# Altium schematic sheet 2V_REG.SchDoc
size A4; SheetNumber: 2; SheetTotal: 12
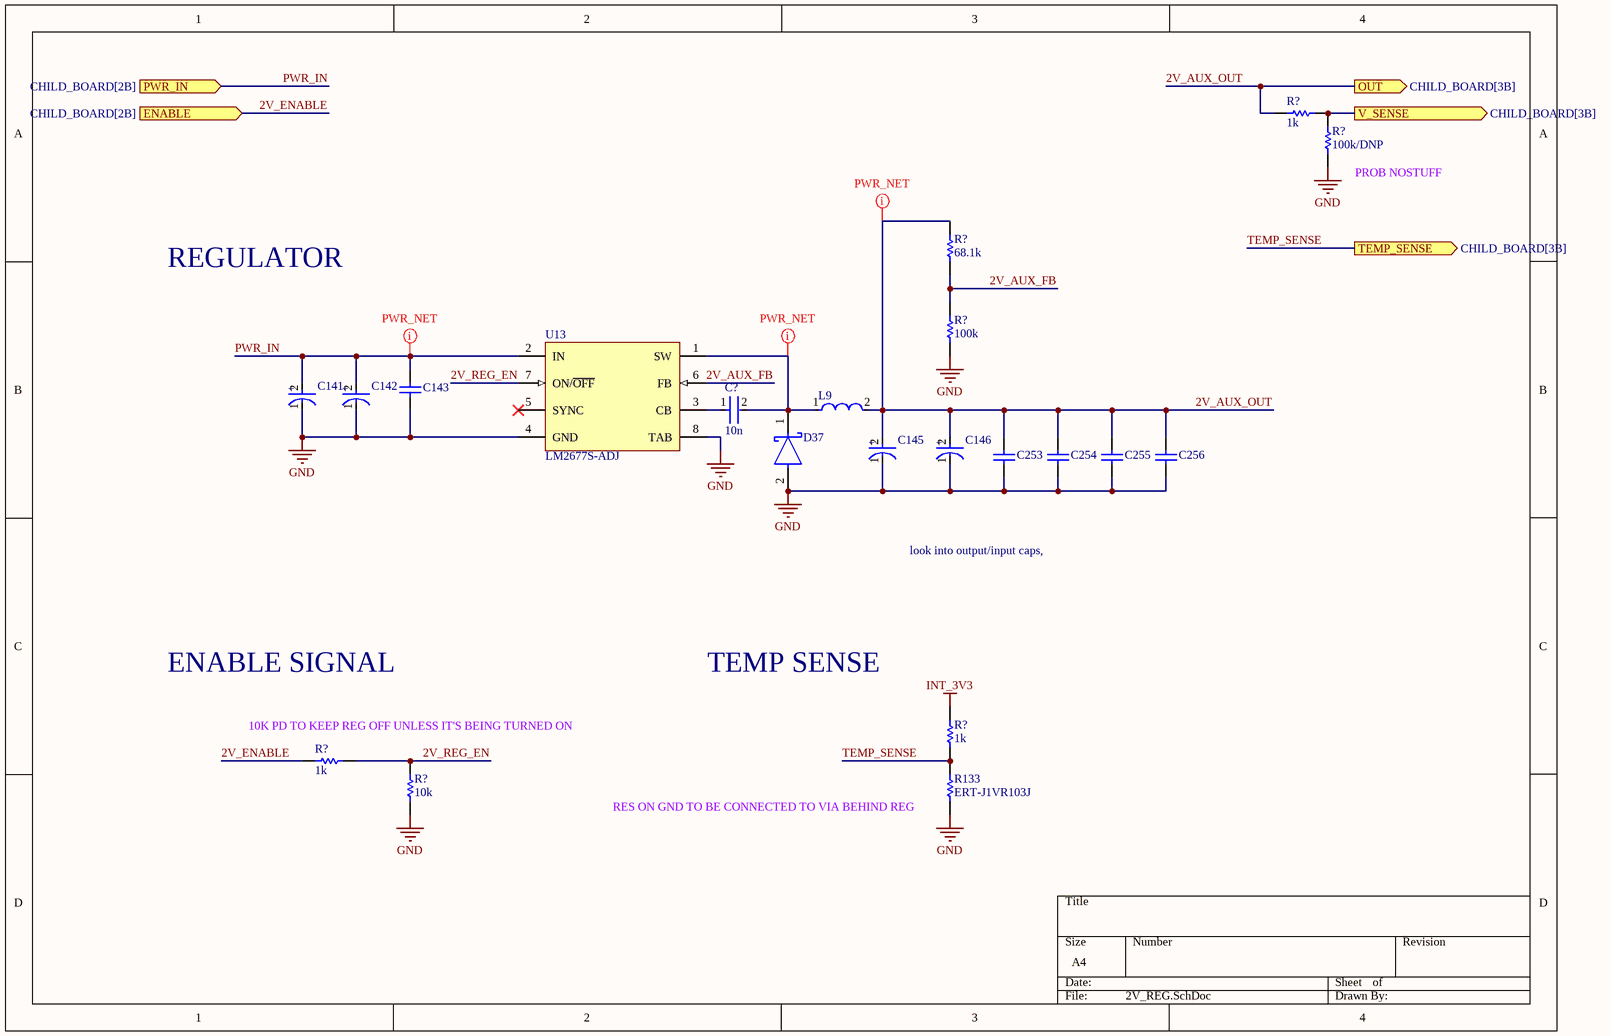
[diagram p0: 2V_REG.SchDoc]

## Parts
(Parts that share a designator on the sheet are numbered #1, #2 ... from top to bottom, then left to right.)
C141  EEHZA1V680XP  [FP-EEH-D8-MFG]  (value not drawn)
C142  EEHZA1V680XP  [FP-EEH-D8-MFG]  (value not drawn)
C143  CAP 470nF 50V 1812(4532)  [CAPC1812(4532)125_M]  (value not drawn)
C145  16SVPC120M  [FP-OS-CON-SMT-E7-MFG]  (value not drawn)
C146  16SVPC120M  [FP-OS-CON-SMT-E7-MFG]  (value not drawn)
C253  CAP 470nF 50V 1812(4532)  [CAPC1812(4532)125_M]  (value not drawn)
C254  CAP 470nF 50V 1812(4532)  [CAPC1812(4532)125_M]  (value not drawn)
C255  CAP 470nF 50V 1812(4532)  [CAPC1812(4532)125_M]  (value not drawn)
C256  CAP 470nF 50V 1812(4532)  [CAPC1812(4532)125_M]  (value not drawn)
C?  10n  [FP-0402-L_1_0_0_05-W_0_5-IPC_A]
D37  B540C-13-F  [FP-SMC-MFG]  (value not drawn)
L9  SRR1260-150M  [FP-SRR1260-MFG]  (value not drawn)
R133  ERT-J1VR103J  [RESC1608X90X30ML15T20]
R?#1  1k  [R0603B]
R?#2  100k/DNP  [R0603B]
R?#3  68.1k  [R0603B]
R?#4  100k  [R0603B]
R?#5  1k  [R0603B]
R?#6  1k  [R0603B]
R?#7  10k  [R0603B]
U13  LM2677S-ADJ  [KTW0007B_M]

## Ports
ENABLE (in, see CHILD_BOARD[2B]), OUT (out, see CHILD_BOARD[3B]), PWR_IN (in, see CHILD_BOARD[2B]), TEMP_SENSE (out, see CHILD_BOARD[3B]), V_SENSE (out, see CHILD_BOARD[3B])

## Nets
GND: C141.1(C) C142.1(C) C143.1 C145.1(C) C146.1(C) C253.1 C254.1 C255.1 C256.1 D37.2(A) R133.1 R?#2.2 R?#4.2 R?#7.2 U13.4(GND) U13.8(TAB)
INT_3V3: R?#5.2
2V_AUX_FB: R?#3.2 R?#4.1 U13.6(FB)
2V_AUX_OUT: C145.2(A) C146.2(A) C253.2 C254.2 C255.2 C256.2 L9.2 R?#1.1 R?#3.1 ; port OUT
2V_ENABLE: R?#6.1 ; port ENABLE
2V_REG_EN: R?#6.2 R?#7.1 U13.7(ON/~{OFF})
PWR_IN: C141.2(A) C142.2(A) C143.2 U13.2(IN) ; port PWR_IN
TEMP_SENSE: R133.2 R?#5.1 ; port TEMP_SENSE
V_SENSE: R?#1.2 R?#2.1 ; port V_SENSE
NetC?_1: C?.1 U13.3(CB)
NetC?_2: C?.2 D37.1(C) L9.1 U13.1(SW)

Not connected (* = marked no-connect by the designer): U13 5(SYNC)*

## Layout directives
net class PWR: 2V_AUX_OUT, NetC?_2, PWR_IN

## Notes on the sheet
- (near R?#2) PROB NOSTUFF
- REGULATOR
- look into output/input caps,
- ENABLE SIGNAL
- TEMP SENSE
- (near R?#6) 10K PD TO KEEP REG OFF UNLESS IT'S BEING TURNED ON
- RES ON GND TO BE CONNECTED TO VIA BEHIND REG
- (in symbol CMP-05428-000021-2) +
- (in symbol CMP-05428-001211-1) +

## Library data of the parts
C141 C142 = CMP-05428-001211-1: Conductive Polymer Hybrid Aluminum Electrolytic Capacitors 68uF ±20% 35V RADIAL SMT 6.3x7.7mm; Leakage Current: 23.8uA; Ripple Current (AC): 2A; Polarity: Polar; Life (Hours): 5000Hour; ESR (Equivalent Series Resistance): 35mR; Lead Diameter: 0.65mm; Termination: SMD/SMT; Case/Package: Radial; Package Quantity: 900; Radiation Hardening: No; Max Operating Temperature: 105°C; Capacitance: 68uF; Voltage Rating: 35V; Number of Pins: 8; Mount: Surface Mount; Technology: HYBRID; Diameter: 6.3mm; Min Operating Temperature: -55°C; Length: 7.7mm; Ratings: AEC-Q200; Height - Seated (Max): 0.315inch; Ripple Current: 2A; Lead Free: Lead Free; Voltage: 35V; Lead Pitch: 1.8mm; Voltage Rating (DC): 35V; REACH SVHC: No SVHC; Material: Polymer; Height: 7.7mm; Tolerance: 20%; Construction: Cylindrical; Packaging: Tape and Reel; Series: ZA
C143 C253-C256 = CMP-1040-01539-1: CAP 470nF 50V ±10% 1812 (4532 Metric) Thickness 1.25mm SMD; Tolerance: Â±10%; Case-Metric: 4532; Case-EIA: 1812; Technology: SMT; Max Thickness: 1.25 mm; Value: 470nF; Rated Voltage: 50 V
C145 C146 = CMP-05428-000021-2: Conductive Polymer Aluminum Solid Capacitors (OS-CON) 120uF ±20% 16V RADIAL SMT 8x6.9mm; Leakage Current: 500uA; Ripple Current: 2.9A; ESR (Equivalent Series Resistance): 27mR; Polarity: Polar; Dissipation Factor: 12%; Life (Hours): 2000Hour; Lead Free: Lead Free; Voltage Rating (DC): 16V; Min Operating Temperature: -55°C; Height - Seated (Max): 0.276inch; Case/Package: Radial; REACH SVHC: No SVHC; Diameter: 8mm; Mount: Surface Mount; Package Quantity: 1000; Construction: Cylindrical; Max Operating Temperature: 105°C; Capacitance: 120uF; Voltage: 16V; Length: 6.9mm; Tolerance: 20%; RoHS Compliant: Yes; Series: OS-CON, SVPC; Packaging: Tape and Reel; Voltage Rating: 16V; Termination: SMD/SMT; Number of Pins: 7; Ripple Current (AC): 2.9A; Height: 6.9mm
C? = CMP-001-00058-1: LARGE PADS, 0402 CAP, CHANGE COMMENT TO MATCH REAL P/N; Capacitor Type: Ceramic; Min Operating Temperature: -55°C; Mounting Technology: Surface Mount; Pins: 2; Case/Package: 0402; RoHS Compliant: Yes; Max Operating Temperature: 85°C
D37 = CMP-2000-05097-3: DIODE SCHOTTKY 40V 5A SMC; Manufacturer: Diodes Inc.; Automotive Grade: NA; Peak Reverse Current: 0.5mA; Value: 300pF; Max Junction Temp: +150°C; Max Surge Forward Current: 100A; Standoff Height: 0.1mm; Digikey Description: DIODE SCHOTTKY 40V 5A SMC; Temperature Range Low: -55°C; Manufacturer Part Number: B540C-13-F; Octopart: https://octopart.com/b540c-13-f-diodes+inc.-325873; Lead Free: Yes; Reverse Voltage: 40V; RoHS: TRUE; Category: Diode; Mouser Description: Diode: Schottky rectifying; SMD; 40V; 5A; SMC; Package: reel, tape; ComponentLink2Description: Datasheet; Temperature Range High: +150°C; Automotive: No; Footprint Url: https://www.diodes.com/assets/Package-Files/SMC.pdf; Device Class L3: Schottky Diodes; Height: 2.5mm; Forward Current: 5A; Temperature: -55°C to +150°C; Package: SMC; ComponentLink2URL: https://www.diodes.com/assets/Datasheets/ds13012.pdf; Device Class L2: Diodes; Max Repetitive Reverse Voltage: 40V; Device Class L1: Discrete Semiconductors; Capacitance: 300pF
L9 = CMP-2000-07146-2: FIXED IND 15UH 5A 27 MOHM SMD; Q Factor: 25; Sample Rate (Hz): 100kHz; Resistance: 27MR; Material: Steel; Inductance Tolerance: 20%; Frequency: 17.6MHz; Saturation Current: 4.6A; Core Material: Ferrite; Shielding: Shielded; Series: SRR1260; Termination: SMD/SMT; Packaging: Tape and Reel; RoHS Compliant: Yes; Height - Seated (Max): 0.256inch; Depth: 12.8mm; Case/Package: 1260; Inductance: 15uH; Height: 6mm; Number of Pins: 2; Mount: Surface Mount; Min Operating Temperature: -40°C; Test Frequency: 100kHz; Length: 12.5mm; Self Resonant Frequency: 17.6MHz; Current Rating: 5A; Tolerance: 20%; RMS Current (Irms): 5A; REACH SVHC: No SVHC; Resistor Type: Wirewound; DC Resistance (DCR): 27mR; Width: 12.5mm; Package Quantity: 600; DC Current: 5A; Max DC Current: 5A; Max Operating Temperature: 125°C; Military Standard: Not
R133 = CMP-2000-00869-1: Manufacturer: Panasonic; Part Number: ERT-J1VR103J
R?#1 R?#3-R?#7 = CMP-009-00002-14: Resistor
  R?#1 R?#5 R?#6: Value: 1k
  R?#3: Value: 68.1k
  R?#4: Value: 100k
  R?#7: Value: 10k
R?#2 = CMP-009-00002-14: Resistor; Value: 100k
U13 = CMP-0069-00211-3: SIMPLE SWITCHER® High Efficiency 5A Step-Down Voltage Regulator with Sync, 7-pin TO-263; Manufacturer: Texas Instruments; PackageTopMarking: NSUZXYTTE#*LM2677S*-ADJ; PowerWise: N; PinCount: 7; CompType: Switcher; ComponentLink1Description: Datasheet URL; PackageReference: KTW0007B; Code_JEDEC: MO-169-AC; ComponentLink1URL: http://www.ti.com/general/docs/lit/getliterature.tsp?genericPartNumber=LM2677&fileType=pdf; PackageDescription: TO-263, Molded, .400 x .390 x .180in Body, 7 Lead, .050in Pitch, Surface Mount; RoHS: N